# EAGLE board clock (EAGLE 6.2)
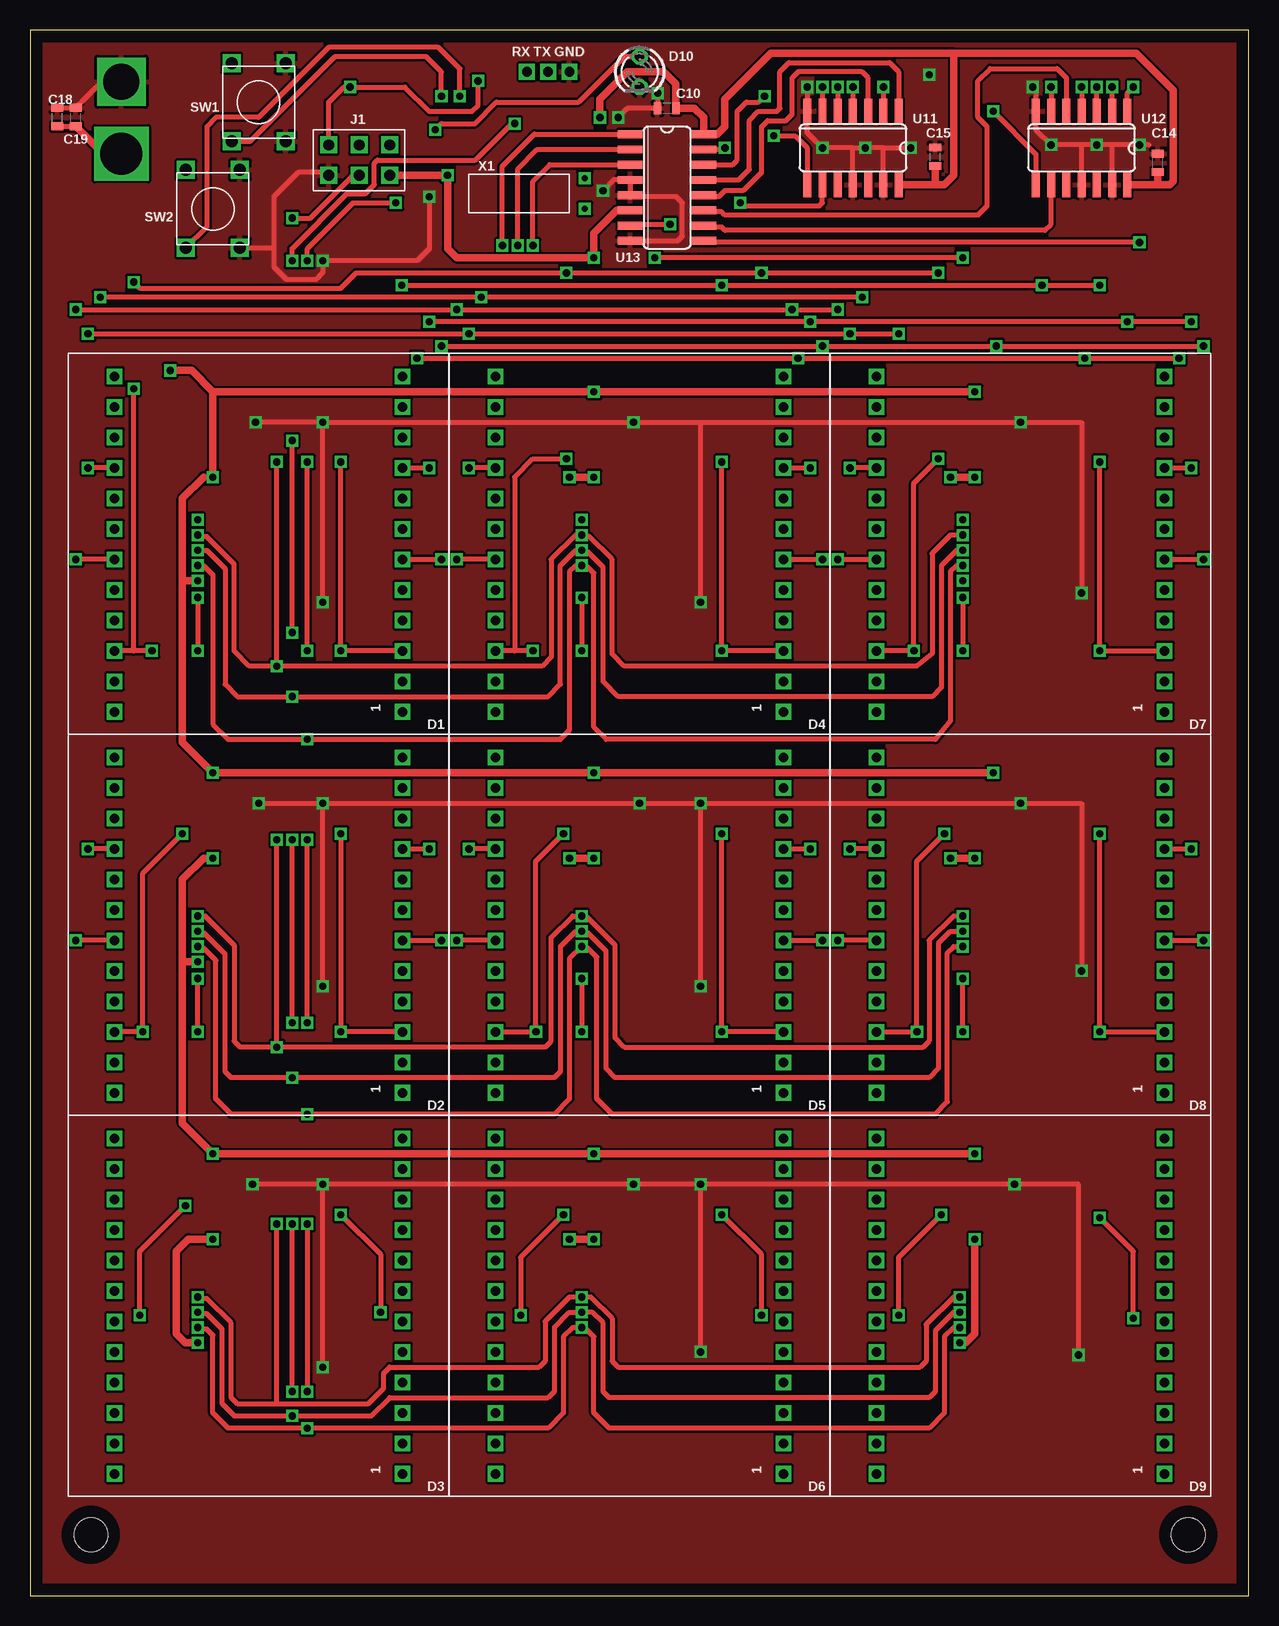
[diagram p3: board, top side]
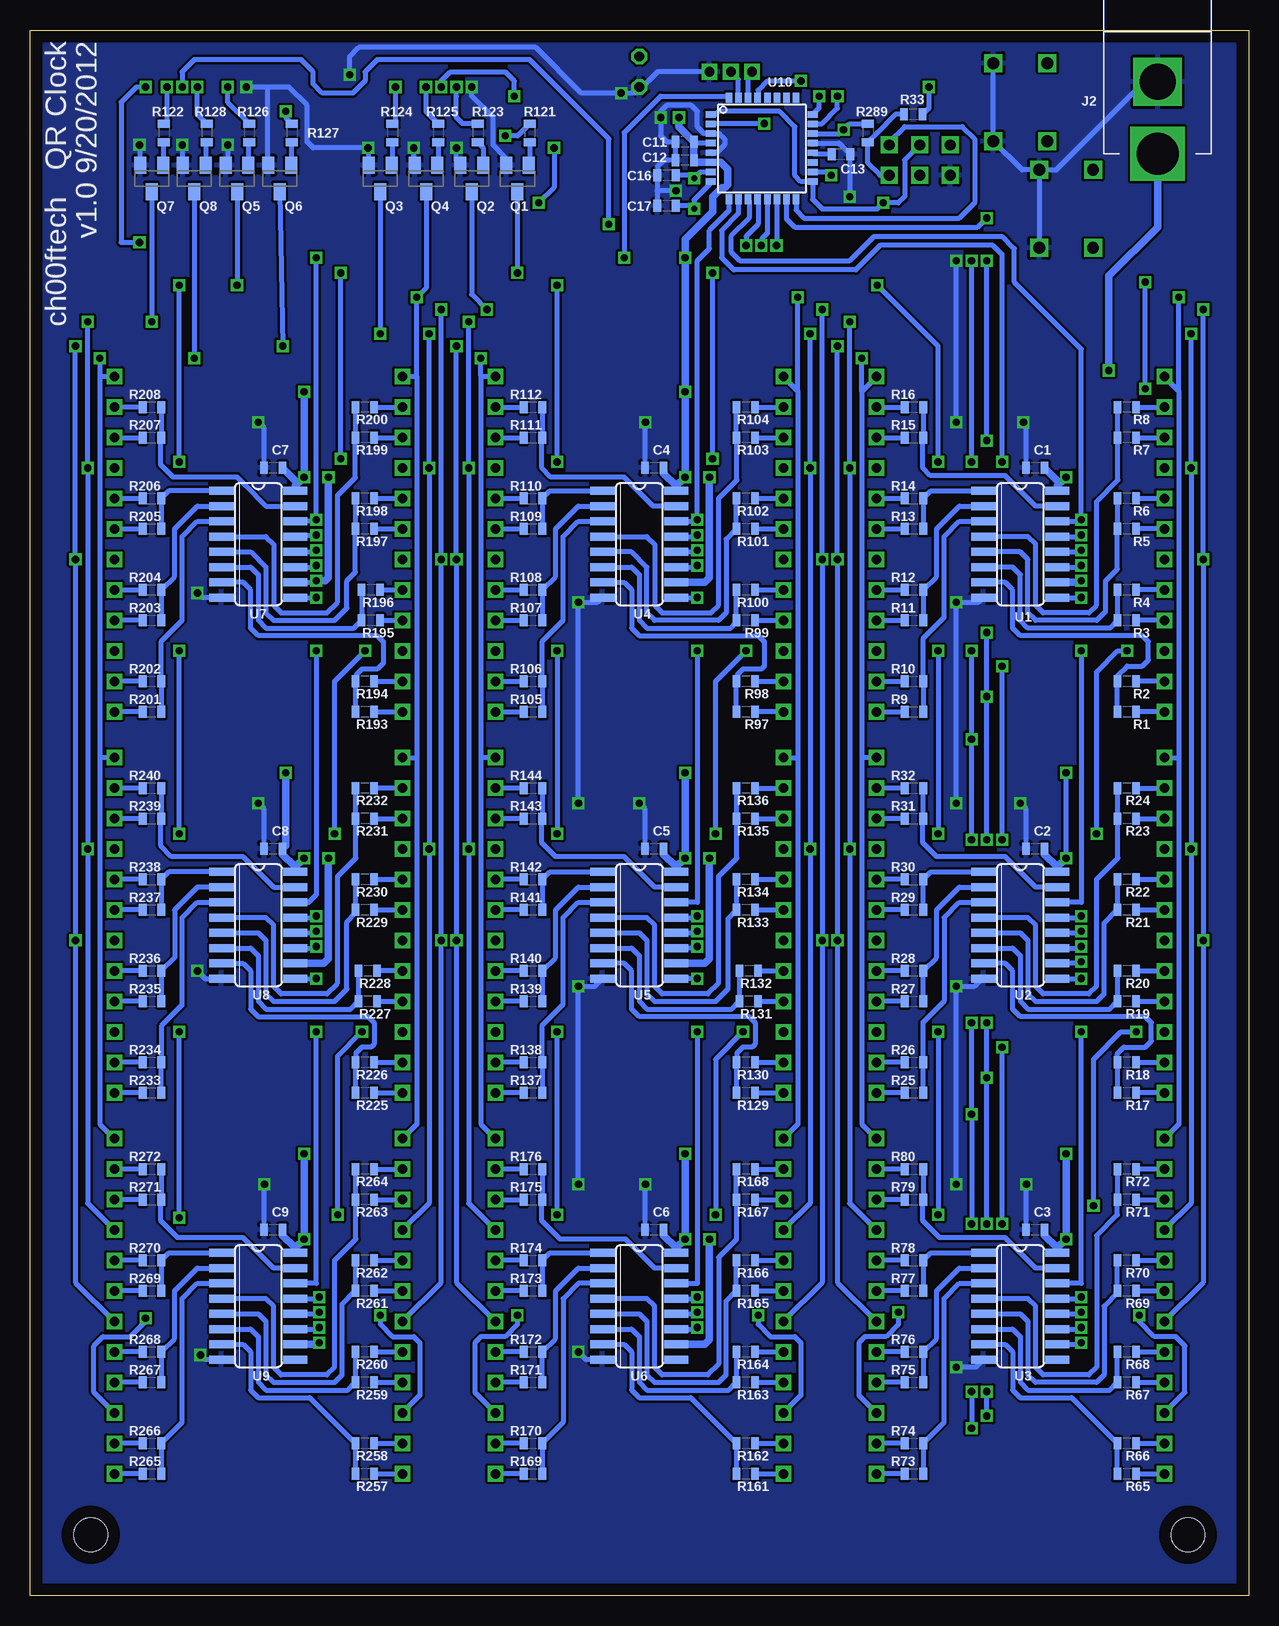
[diagram p4: board, bottom side, seen from below]

Size 101.58 x 130.48 mm. Coordinates in mm from the lower left corner, seen from the top.
Outline: 0,0 101.58,0 101.58,130.48 0,130.48 0,0
Copper layers (1*16): Top 0.035mm / dielectric 1.5mm / Bottom 0.035mm
Design rules: minimum track width 10mil, minimum drill 6mil, track to track 8mil, track to pad 8mil, pad to pad 8mil, via to via 8mil, smd to smd 8mil, copper to edge 40mil, drill to drill 8mil, minimum pad ring 10mil, minimum via ring 8mil, stop-mask expansion 4mil, vias tented up to drill 0mil, thermal gap 10mil
Holes 2.8 mm at 5.08,5.08 96.52,5.08

## Footprints (pad centres in the part's own frame; a part is rotated, then mirrored left to right if it is on the bottom)
0603/1608METRIC = smd 0.65 x 1: P1 -0.74,0; P2 0.8,0
BL-M12A883DUG-11 = drill 0.8 square: P1 -13.97,-12; P2 -11.43,-12; P3 -8.89,-12; P4 -6.35,-12; P5 -3.81,-12; P6 -1.27,-12; P7 1.27,-12; P8 3.81,-12; P9 6.35,-12; P10 8.89,-12; P11 11.43,-12; P12 13.97,-12; P13 13.97,12; P14 11.43,12; P15 8.89,12; P16 6.35,12; P17 3.81,12; P18 1.27,12; P19 -1.27,12; P20 -3.81,12; P21 -6.35,12; P22 -8.89,12; P23 -11.43,12; P24 -13.97,12
LED3MM = drill 0.813 octagon: A -1.27,0; K 1.27,0
HEADERPIN = drill 0.8 square: P$1 0,0
ATMEL-PROGRAMMING-HEADER = drill 0.9 square: P1 -2.54,-1.27; P2 -2.54,1.27; P3 0,-1.27; P4 0,1.27; P5 2.54,-1.27; P6 2.54,1.27
PJ-037A = drill 3 square: BARREL 7.696,0 | drill 3.5 square: PIN 13.691,0
SOT23 = smd 1 x 1.4: 1 -0.95,-1.1; 2 0.95,-1.1; 3 0,1.1
FSM16JHSWITCH = drill 0.991 square: P1 3.251,2.248; P2 -3.251,2.248; P3 3.251,-2.248; P4 -3.251,-2.248
SO16 = smd 0.66 x 2.032: 1 -4.445,-3.073; 2 -3.175,-3.073; 3 -1.905,-3.073; 4 -0.635,-3.073; 5 0.635,-3.073; 6 1.905,-3.073; 7 3.175,-3.073; 8 4.445,-3.073; 9 4.445,3.073; 10 3.175,3.073; 11 1.905,3.073; 12 0.635,3.073; 13 -0.635,3.073; 14 -1.905,3.073; 15 -3.175,3.073; 16 -4.445,3.073
TQFP-32 = smd 0.85 x 0.54: P1 -4.22,2.8; P2 -4.22,2; P3 -4.22,1.2; P4 -4.22,0.4; P5 -4.22,-0.4; P6 -4.22,-1.2; P7 -4.22,-2; P8 -4.22,-2.8; P17 4.28,-2.8; P18 4.28,-2; P19 4.28,-1.2; P20 4.28,-0.4; P21 4.28,0.4; P22 4.28,1.2; P23 4.28,2; P24 4.28,2.8 | smd 0.54 x 0.85: P9 -2.7,-4.28; P10 -1.9,-4.28; P11 -1.1,-4.28; P12 -0.3,-4.28; P13 0.5,-4.28; P14 1.3,-4.28; P15 2.1,-4.28; P16 2.9,-4.28; P25 2.9,4.18; P26 2.1,4.18; P27 1.3,4.18; P28 0.5,4.18; P29 -0.3,4.18; P30 -1.1,4.18; P31 -1.9,4.18; P32 -2.7,4.18
SO14 = smd 0.66 x 2.032: 1 -3.81,-3.073; 2 -2.54,-3.073; 3 -1.27,-3.073; 4 0,-3.073; 5 1.27,-3.073; 6 2.54,-3.073; 7 3.81,-3.073; 8 3.81,3.073; 9 2.54,3.073; 10 1.27,3.073; 11 0,3.073; 12 -1.27,3.073; 13 -2.54,3.073; 14 -3.81,3.073
AB38T = drill 0.5 square: P$1 2.54,1.27; P$2 2.54,-1.27

## Placement (x,y rotation side)
C1  .1uF  [0603/1608METRIC]  17.78,93.98 180 bottom
C2  .1uF  [0603/1608METRIC]  17.78,62.23 180 bottom
C3  .1uF  [0603/1608METRIC]  17.78,30.48 180 bottom
C4  .1uF  [0603/1608METRIC]  49.53,93.98 180 bottom
C5  .1uF  [0603/1608METRIC]  49.53,62.23 180 bottom
C6  .1uF  [0603/1608METRIC]  49.53,30.48 180 bottom
C7  .1uF  [0603/1608METRIC]  81.28,93.98 180 bottom
C8  .1uF  [0603/1608METRIC]  81.28,62.23 180 bottom
C9  .1uF  [0603/1608METRIC]  81.28,30.48 180 bottom
C10  .1uF  [0603/1608METRIC]  53.09,123.95 180 top
C11  .1uF  [0603/1608METRIC]  46.99,121.16 180 bottom
C12  .1uF  [0603/1608METRIC]  46.99,119.63 180 bottom
C13  .1uF  [0603/1608METRIC]  34.04,120.14 0 bottom
C14  .1uF  [0603/1608METRIC]  93.98,119.38 90 top
C15  .1uF  [0603/1608METRIC]  75.44,119.89 90 top
C16  6pF  [0603/1608METRIC]  48.51,118.36 180 bottom
C17  16pF  [0603/1608METRIC]  48.51,115.82 180 bottom
C18  1uF  [0603/1608METRIC]  2.29,123.19 90 top
C19  1uF  [0603/1608METRIC]  3.81,123.19 90 top
D1  BL-M12A883DUG-11"  [BL-M12A883DUG-11]  19.05,87.63 90 top
D2  BL-M12A883DUG-11"  [BL-M12A883DUG-11]  19.05,55.88 90 top
D3  BL-M12A883DUG-11"  [BL-M12A883DUG-11]  19.05,24.13 90 top
D4  BL-M12A883DUG-11"  [BL-M12A883DUG-11]  50.8,87.63 90 top
D5  BL-M12A883DUG-11"  [BL-M12A883DUG-11]  50.8,55.88 90 top
D6  BL-M12A883DUG-11"  [BL-M12A883DUG-11]  50.8,24.13 90 top
D7  BL-M12A883DUG-11"  [BL-M12A883DUG-11]  82.55,87.63 90 top
D8  BL-M12A883DUG-11"  [BL-M12A883DUG-11]  82.55,55.88 90 top
D9  BL-M12A883DUG-11"  [BL-M12A883DUG-11]  82.55,24.13 90 top
D10  TEPT4400  [LED3MM]  50.8,127 270 top
GND  HEADERPIN  [HEADERPIN]  44.96,127 0 top
J1  PROGHEADER-PINS  [ATMEL-PROGRAMMING-HEADER]  27.43,119.63 180 top
J2  [PJ-037A]  7.62,133.86 270 bottom
Q1  FDN335  [SOT23]  60.96,118.11 180 bottom
Q2  FDN335  [SOT23]  64.77,118.11 180 bottom
Q3  FDN335  [SOT23]  72.39,118.11 180 bottom
Q4  FDN335  [SOT23]  68.58,118.11 180 bottom
Q5  FDN335  [SOT23]  84.33,118.11 180 bottom
Q6  FDN335  [SOT23]  80.77,118.11 180 bottom
Q7  FDN335  [SOT23]  91.44,118.11 180 bottom
Q8  FDN335  [SOT23]  87.88,118.11 180 bottom
R1  100  [0603/1608METRIC]  10.16,73.66 180 bottom
R2  100  [0603/1608METRIC]  10.16,76.2 180 bottom
R3  100  [0603/1608METRIC]  10.16,81.28 180 bottom
R4  100  [0603/1608METRIC]  10.16,83.82 180 bottom
R5  100  [0603/1608METRIC]  10.16,88.9 180 bottom
R6  100  [0603/1608METRIC]  10.16,91.44 180 bottom
R7  100  [0603/1608METRIC]  10.16,96.52 180 bottom
R8  100  [0603/1608METRIC]  10.16,99.06 180 bottom
R9  100  [0603/1608METRIC]  27.94,73.66 0 bottom
R10  100  [0603/1608METRIC]  27.94,76.2 0 bottom
R11  100  [0603/1608METRIC]  27.94,81.28 0 bottom
R12  100  [0603/1608METRIC]  27.94,83.82 0 bottom
R13  100  [0603/1608METRIC]  27.94,88.9 0 bottom
R14  100  [0603/1608METRIC]  27.94,91.44 0 bottom
R15  100  [0603/1608METRIC]  27.94,96.52 0 bottom
R16  100  [0603/1608METRIC]  27.94,99.06 0 bottom
R17  100  [0603/1608METRIC]  10.16,41.91 180 bottom
R18  100  [0603/1608METRIC]  10.16,44.45 180 bottom
R19  100  [0603/1608METRIC]  10.16,49.53 180 bottom
R20  100  [0603/1608METRIC]  10.16,52.07 180 bottom
R21  100  [0603/1608METRIC]  10.16,57.15 180 bottom
R22  100  [0603/1608METRIC]  10.16,59.69 180 bottom
R23  100  [0603/1608METRIC]  10.16,64.77 180 bottom
R24  100  [0603/1608METRIC]  10.16,67.31 180 bottom
R25  100  [0603/1608METRIC]  27.94,41.91 0 bottom
R26  100  [0603/1608METRIC]  27.94,44.45 0 bottom
R27  100  [0603/1608METRIC]  27.94,49.53 0 bottom
R28  100  [0603/1608METRIC]  27.94,52.07 0 bottom
R29  100  [0603/1608METRIC]  27.94,57.15 0 bottom
R30  100  [0603/1608METRIC]  27.94,59.69 0 bottom
R31  100  [0603/1608METRIC]  27.94,64.77 0 bottom
R32  100  [0603/1608METRIC]  27.94,67.31 0 bottom
R33  4.7k  [0603/1608METRIC]  27.94,123.44 180 bottom
R65  100  [0603/1608METRIC]  10.16,10.16 180 bottom
R66  100  [0603/1608METRIC]  10.16,12.7 180 bottom
R67  100  [0603/1608METRIC]  10.16,17.78 180 bottom
R68  100  [0603/1608METRIC]  10.16,20.32 180 bottom
R69  100  [0603/1608METRIC]  10.16,25.4 180 bottom
R70  100  [0603/1608METRIC]  10.16,27.94 180 bottom
R71  100  [0603/1608METRIC]  10.16,33.02 180 bottom
R72  100  [0603/1608METRIC]  10.16,35.56 180 bottom
R73  100  [0603/1608METRIC]  27.94,10.16 0 bottom
R74  100  [0603/1608METRIC]  27.94,12.7 0 bottom
R75  100  [0603/1608METRIC]  27.94,17.78 0 bottom
R76  100  [0603/1608METRIC]  27.94,20.32 0 bottom
R77  100  [0603/1608METRIC]  27.94,25.4 0 bottom
R78  100  [0603/1608METRIC]  27.94,27.94 0 bottom
R79  100  [0603/1608METRIC]  27.94,33.02 0 bottom
R80  100  [0603/1608METRIC]  27.94,35.56 0 bottom
R97  100  [0603/1608METRIC]  41.91,73.66 180 bottom
R98  100  [0603/1608METRIC]  41.91,76.2 180 bottom
R99  100  [0603/1608METRIC]  41.91,81.28 180 bottom
R100  100  [0603/1608METRIC]  41.91,83.82 180 bottom
R101  100  [0603/1608METRIC]  41.91,88.9 180 bottom
R102  100  [0603/1608METRIC]  41.91,91.44 180 bottom
R103  100  [0603/1608METRIC]  41.91,96.52 180 bottom
R104  100  [0603/1608METRIC]  41.91,99.06 180 bottom
R105  100  [0603/1608METRIC]  59.69,73.66 0 bottom
R106  100  [0603/1608METRIC]  59.69,76.2 0 bottom
R107  100  [0603/1608METRIC]  59.69,81.28 0 bottom
R108  100  [0603/1608METRIC]  59.69,83.82 0 bottom
R109  100  [0603/1608METRIC]  59.69,88.9 0 bottom
R110  100  [0603/1608METRIC]  59.69,91.44 0 bottom
R111  100  [0603/1608METRIC]  59.69,96.52 0 bottom
R112  100  [0603/1608METRIC]  59.69,99.06 0 bottom
R121  2k  [0603/1608METRIC]  59.94,121.92 270 bottom
R122  2k  [0603/1608METRIC]  90.42,121.92 270 bottom
R123  2k  [0603/1608METRIC]  64.26,121.92 270 bottom
R124  2k  [0603/1608METRIC]  71.37,121.92 270 bottom
R125  2k  [0603/1608METRIC]  67.56,121.92 270 bottom
R126  2k  [0603/1608METRIC]  83.31,121.92 270 bottom
R127  2k  [0603/1608METRIC]  79.76,121.92 270 bottom
R128  2k  [0603/1608METRIC]  86.87,121.92 270 bottom
R129  100  [0603/1608METRIC]  41.91,41.91 180 bottom
R130  100  [0603/1608METRIC]  41.91,44.45 180 bottom
R131  100  [0603/1608METRIC]  41.66,49.53 180 bottom
R132  100  [0603/1608METRIC]  41.66,52.07 180 bottom
R133  100  [0603/1608METRIC]  41.91,57.15 180 bottom
R134  100  [0603/1608METRIC]  41.91,59.69 180 bottom
R135  100  [0603/1608METRIC]  41.91,64.77 180 bottom
R136  100  [0603/1608METRIC]  41.91,67.31 180 bottom
R137  100  [0603/1608METRIC]  59.69,41.91 0 bottom
R138  100  [0603/1608METRIC]  59.69,44.45 0 bottom
R139  100  [0603/1608METRIC]  59.69,49.53 0 bottom
R140  100  [0603/1608METRIC]  59.69,52.07 0 bottom
R141  100  [0603/1608METRIC]  59.69,57.15 0 bottom
R142  100  [0603/1608METRIC]  59.69,59.69 0 bottom
R143  100  [0603/1608METRIC]  59.69,64.77 0 bottom
R144  100  [0603/1608METRIC]  59.69,67.31 0 bottom
R161  100  [0603/1608METRIC]  41.91,10.16 180 bottom
R162  100  [0603/1608METRIC]  41.91,12.7 180 bottom
R163  100  [0603/1608METRIC]  41.91,17.78 180 bottom
R164  100  [0603/1608METRIC]  41.91,20.32 180 bottom
R165  100  [0603/1608METRIC]  41.91,25.4 180 bottom
R166  100  [0603/1608METRIC]  41.91,27.94 180 bottom
R167  100  [0603/1608METRIC]  41.91,33.02 180 bottom
R168  100  [0603/1608METRIC]  41.91,35.56 180 bottom
R169  100  [0603/1608METRIC]  59.69,10.16 0 bottom
R170  100  [0603/1608METRIC]  59.69,12.7 0 bottom
R171  100  [0603/1608METRIC]  59.69,17.78 0 bottom
R172  100  [0603/1608METRIC]  59.69,20.32 0 bottom
R173  100  [0603/1608METRIC]  59.69,25.4 0 bottom
R174  100  [0603/1608METRIC]  59.69,27.94 0 bottom
R175  100  [0603/1608METRIC]  59.69,33.02 0 bottom
R176  100  [0603/1608METRIC]  59.69,35.56 0 bottom
R193  100  [0603/1608METRIC]  73.66,73.66 180 bottom
R194  100  [0603/1608METRIC]  73.66,76.2 180 bottom
R195  100  [0603/1608METRIC]  73.15,81.28 180 bottom
R196  100  [0603/1608METRIC]  73.15,83.82 180 bottom
R197  100  [0603/1608METRIC]  73.66,88.9 180 bottom
R198  100  [0603/1608METRIC]  73.66,91.44 180 bottom
R199  100  [0603/1608METRIC]  73.66,96.52 180 bottom
R200  100  [0603/1608METRIC]  73.66,99.06 180 bottom
R201  100  [0603/1608METRIC]  91.44,73.66 0 bottom
R202  100  [0603/1608METRIC]  91.44,76.2 0 bottom
R203  100  [0603/1608METRIC]  91.44,81.28 0 bottom
R204  100  [0603/1608METRIC]  91.44,83.82 0 bottom
R205  100  [0603/1608METRIC]  91.44,88.9 0 bottom
R206  100  [0603/1608METRIC]  91.44,91.44 0 bottom
R207  100  [0603/1608METRIC]  91.44,96.52 0 bottom
R208  100  [0603/1608METRIC]  91.44,99.06 0 bottom
R225  100  [0603/1608METRIC]  73.66,41.91 180 bottom
R226  100  [0603/1608METRIC]  73.66,44.45 180 bottom
R227  100  [0603/1608METRIC]  73.41,49.53 180 bottom
R228  100  [0603/1608METRIC]  73.41,52.07 180 bottom
R229  100  [0603/1608METRIC]  73.66,57.15 180 bottom
R230  100  [0603/1608METRIC]  73.66,59.69 180 bottom
R231  100  [0603/1608METRIC]  73.66,64.77 180 bottom
R232  100  [0603/1608METRIC]  73.66,67.31 180 bottom
R233  100  [0603/1608METRIC]  91.44,41.91 0 bottom
R234  100  [0603/1608METRIC]  91.44,44.45 0 bottom
R235  100  [0603/1608METRIC]  91.44,49.53 0 bottom
R236  100  [0603/1608METRIC]  91.44,52.07 0 bottom
R237  100  [0603/1608METRIC]  91.44,57.15 0 bottom
R238  100  [0603/1608METRIC]  91.44,59.69 0 bottom
R239  100  [0603/1608METRIC]  91.44,64.77 0 bottom
R240  100  [0603/1608METRIC]  91.44,67.31 0 bottom
R257  100  [0603/1608METRIC]  73.66,10.16 180 bottom
R258  100  [0603/1608METRIC]  73.66,12.7 180 bottom
R259  100  [0603/1608METRIC]  73.66,17.78 180 bottom
R260  100  [0603/1608METRIC]  73.66,20.32 180 bottom
R261  100  [0603/1608METRIC]  73.66,25.4 180 bottom
R262  100  [0603/1608METRIC]  73.66,27.94 180 bottom
R263  100  [0603/1608METRIC]  73.66,33.02 180 bottom
R264  100  [0603/1608METRIC]  73.66,35.56 180 bottom
R265  100  [0603/1608METRIC]  91.44,10.16 0 bottom
R266  100  [0603/1608METRIC]  91.44,12.7 0 bottom
R267  100  [0603/1608METRIC]  91.44,17.78 0 bottom
R268  100  [0603/1608METRIC]  91.44,20.32 0 bottom
R269  100  [0603/1608METRIC]  91.44,25.4 0 bottom
R270  100  [0603/1608METRIC]  91.44,27.94 0 bottom
R271  100  [0603/1608METRIC]  91.44,33.02 0 bottom
R272  100  [0603/1608METRIC]  91.44,35.56 0 bottom
R289  47k  [0603/1608METRIC]  31.75,121.92 270 bottom
RX  HEADERPIN  [HEADERPIN]  41.4,127 0 top
SW1  4mm  [FSM16JHSWITCH]  19.05,124.46 90 top
SW2  4mm  [FSM16JHSWITCH]  15.24,115.57 90 top
TX  HEADERPIN  [HEADERPIN]  43.18,127 0 top
U1  74HC595  [SO16]  19.05,87.63 270 bottom
U2  74HC595  [SO16]  19.05,55.88 270 bottom
U3  74HC595  [SO16]  19.05,24.13 270 bottom
U4  74HC595  [SO16]  50.8,87.63 270 bottom
U5  74HC595  [SO16]  50.8,55.88 270 bottom
U6  74HC595  [SO16]  50.8,24.13 270 bottom
U7  74HC595  [SO16]  82.55,87.63 270 bottom
U8  74HC595  [SO16]  82.55,55.88 270 bottom
U9  74HC595  [SO16]  82.55,24.13 270 bottom
U10  ATMega48A  [TQFP-32]  40.64,120.65 0 bottom
U11  74HC14  [SO14]  68.58,120.65 180 top
U12  74HC14  [SO14]  87.63,120.65 180 top
U13  74HC138  [SO16]  53.09,117.35 270 top
X1  [AB38T]  43.69,116.84 0 top

## Tracks (layer width: path | path; a pad name or v marks a point on that pad's centre or on a via)
!OE  (via drill 0.6)
  Top 0.406: v13.97,24.89 14.1,24.77 14.73,24.77 16.76,22.73 16.76,16.51 17.27,16 20.57,16 | v77.47,24.89 76.96,24.89 74.68,22.61 74.68,19.56 74.17,19.05 49.02,19.05 48.51,19.56 48.51,23.11 46.74,24.89 v45.97,24.89 44.96,24.89 42.93,22.86 42.93,19.56 42.42,19.05 29.97,19.05 29.46,18.54 29.46,17.27 28.19,16 20.57,16 | v20.57,45.72 42.93,45.72 43.43,46.23 43.43,54.86 45.21,56.64 v45.97,56.64 | v20.57,45.72 17.53,45.72 17.02,46.23 17.02,54.23 14.61,56.64 v13.97,56.64 | v77.72,56.64 76.96,56.64 74.93,54.61 74.93,46.23 74.42,45.72 49.53,45.72 48.77,46.48 48.77,54.23 46.48,56.52 46.1,56.52 v45.97,56.64 | v45.97,56.64 46.23,56.64 | v20.57,77.47 42.67,77.47 43.43,78.23 43.43,86.36 45.47,88.39 v45.97,88.39 46.35,88.39 46.48,88.27 46.61,88.27 48.51,86.36 48.51,78.49 49.53,77.47 73.91,77.47 75.18,78.49 75.18,86.87 76.71,88.39 v77.72,88.39 | v20.57,77.47 18.29,77.47 17.02,78.74 17.02,85.98 14.73,88.27 14.1,88.27 v13.97,88.39 | 20.57,16 v20.57,30.99 | v20.57,45.72 v20.57,62.99 | v20.57,77.47 v20.57,94.49
  Bottom 0.406: U3.13 14.1,24.77 v13.97,24.89 | U9.13 77.6,24.77 v77.47,24.89 | U8.13 77.6,56.52 v77.72,56.64 | U1.13 14.1,88.27 v13.97,88.39 | U6.13 46.1,24.77 v45.97,24.89 | U2.13 14.1,56.52 v13.97,56.64 | U5.13 46.1,56.52 v45.97,56.64 | U4.13 46.1,88.27 v45.97,88.39 | U7.13 79.35,88.39 v77.72,88.39 | v20.57,30.99 v20.57,45.72 | v20.57,62.99 v20.57,77.47 | v20.57,94.49 20.57,111.76 21.34,112.52 30.73,112.52 32.77,110.49 42.93,110.49 43.94,111.51 43.94,113.79 42.54,115.19 U10.P10
!RESET  (via drill 0.6)
  Top 0.406: J1.P5 24.89,124.46 26.16,125.73 v26.67,125.73 31.24,125.73 33.27,123.7 36.83,123.7 37.34,124.21 v37.34,126.24
  Bottom 0.406: U10.P29 40.89,124.88 40.89,125.48 40.13,126.24 v37.34,126.24 | v26.67,125.73 26.67,123.97 R33.P1
+5V  (via drill 0.6)
  Top 0.406: 14.48,93.22 v15.24,93.22 | 72.42,117.6 U11.14 | 56.13,121.82 U13.16 | C18.P1 C19.P1
  Top 0.61: v44.96,29.72 v46.99,29.72 | v44.96,61.47 v46.99,61.47 | v76.71,61.47 v78.74,61.47 | v13.97,21.08 12.95,21.08 12.19,21.84 12.19,28.7 13.21,29.72 v15.24,29.72 | v77.47,21.08 77.98,21.08 78.74,21.84 v78.74,29.72 | v78.74,36.83 v46.99,36.83 v15.24,36.83 12.7,39.37 12.7,52.83 | 12.7,52.83 12.7,59.69 14.48,61.47 v15.24,61.47 | v80.26,68.58 v46.99,68.58 v15.24,68.58 12.7,71.12 12.7,84.58 | v13.97,52.83 12.7,52.83 | 12.7,84.58 12.7,91.44 14.48,93.22 | v44.96,93.22 v46.99,93.22 | v76.71,93.22 v78.74,93.22 | 15.24,100.33 v46.99,100.33 v78.74,100.33 | 15.24,100.33 v15.24,93.22 | v13.97,84.58 12.7,84.58 | U12.14 93.98,117.58 | 93.98,117.58 C14.P1 | 75.44,117.6 76.2,117.6 76.96,118.36 76.96,128.52 | 75.44,117.6 72.42,117.6 | 93.98,117.58 94.97,117.58 95.25,117.86 95.25,125.48 92.2,128.52 76.96,128.52 | U13.16 57.28,121.79 57.91,122.43 57.91,124.71 61.72,128.52 76.96,128.52 | U13.6 48.9,115.44 46.99,113.54 v46.99,111.51 35.56,111.51 34.8,112.27 v34.8,118.36 J1.P2 | 56.13,121.82 56.13,123.19 55.37,123.95 C10.P1 53.83,126.01 52.83,127 49.78,127 47.5,124.71 v47.5,123.19 | C19.P1 6.09,120.17 J2.PIN | 15.24,100.33 13.46,102.11 v11.68,102.11 | C15.P1 75.44,117.6
  Bottom 0.406: U2.16 15.98,60.73 | v13.97,52.83 14.1,52.7 U2.10 | U3.16 15.98,28.98 | U5.16 47.73,60.73 | 77.6,20.95 v77.47,21.08 | U6.16 47.73,28.98 | U9.16 79.48,28.98 | U3.10 14.1,20.95 v13.97,21.08 | U8.16 79.48,60.73 | U7.10 77.72,84.45 | 77.72,84.45 77.6,84.45 | U7.16 79.48,92.48 79.48,92.92 | 14.1,84.45 v13.97,84.58 | U1.16 15.98,92.48 15.98,92.92 | U4.16 47.73,92.48 | 17.04,30.05 C3.P1 | v15.24,61.47 v15.24,68.58 | C8.P1 80.26,62.51 | 48.79,93.55 C4.P1 | v34.8,118.36 35.05,118.62 36.33,118.62 U10.P18 | J1.P2 30.73,118.36 31.75,119.38 R289.P2 30.99,121.88 30.99,121.92 29.46,123.44 R33.P2 | 46.07,119.45 C12.P1 | v77.72,84.58 77.72,84.45 | U10.P4 46.14,121.05 C11.P1
  Bottom 0.61: v15.24,61.47 15.98,60.73 17.04,61.8 C2.P1 | U9.10 77.6,20.95 | v78.74,61.47 79.48,60.73 80.54,61.8 C8.P1 | 79.48,92.48 v78.74,93.22 v78.74,100.33 | U1.10 14.1,84.45 | 15.98,92.48 v15.24,93.22 | U6.10 45.34,20.95 44.96,21.34 v44.96,29.72 | U5.10 45.34,52.7 44.96,53.09 v44.96,61.47 | v76.71,61.47 76.71,53.09 77.09,52.7 U8.10 | 17.04,30.05 15.98,28.98 v15.24,29.72 v15.24,36.83 | C6.P1 48.79,30.05 47.73,28.98 v46.99,29.72 v46.99,36.83 | C9.P1 80.54,30.05 79.48,28.98 v78.74,29.72 v78.74,36.83 | C5.P1 48.79,61.8 47.73,60.73 v46.99,61.47 v46.99,68.58 | 80.26,62.51 v80.26,68.58 | U4.10 45.34,84.45 44.96,84.84 v44.96,93.22 | 15.98,92.92 C1.P1 | 79.48,92.92 C7.P1 | v77.72,84.58 76.96,84.58 76.71,84.84 v76.71,93.22 | 48.79,93.55 47.73,92.48 v46.99,93.22 v46.99,100.33 v46.99,111.51 46.99,113.03 44.7,115.32 44.7,116.59 43.94,117.35 43.69,117.35 43.43,117.6 43.43,118.87 44.01,119.45 U10.P6 46.07,119.45 | C12.P1 C11.P1 46.25,121.18 47.5,122.43 v47.5,123.19 | v11.68,102.11 11.68,109.98 7.62,114.05 J2.PIN
GND  (via drill 0.6)
  Top 0.406: v24.38,19.05 v24.38,34.29 | v55.88,34.29 v50.29,34.29 v24.38,34.29 | v24.38,34.29 v18.54,34.29 | v55.88,20.32 v55.88,34.29 | v87.38,20.07 87.38,34.29 v82.04,34.29 v55.88,34.29 | v19.05,66.04 v24.38,66.04 | v24.38,50.8 v24.38,66.04 | v24.38,66.04 v50.8,66.04 v55.88,66.04 | v55.88,66.04 v82.55,66.04 87.63,66.04 v87.63,52.07 | v55.88,50.8 v55.88,66.04 | v24.38,82.8 v24.38,97.79 | v24.38,97.79 v18.8,97.79 | v24.38,97.79 v50.29,97.79 55.88,97.79 | 55.88,97.79 v82.55,97.79 87.63,97.79 v87.63,83.57 | v55.88,82.8 55.88,97.79 | U11.11 68.58,120.65 | 68.58,120.65 v69.6,120.65 71.12,120.65 | 68.58,120.65 v66.04,120.65 64.77,121.92 U11.7 v64.77,125.73 | U11.13 71.12,120.65 | 71.12,120.65 v73.41,120.65 | U12.11 87.63,120.9 | 87.63,120.9 v85.09,120.9 83.82,122.17 U12.7 83.82,125.48 v83.57,125.73 | U12.13 90.17,120.9 | 90.17,120.9 v88.9,120.9 87.63,120.9 | 90.17,120.9 v92.46,120.9 93.26,120.9 | v52.32,125.22 52.32,123.99 C10.P2 49.78,123.95 v49.02,123.19 | U13.8 53.98,112.9 54.36,113.28 54.36,116.08 53.85,116.59 50.14,116.59 U13.5 U13.4 48.64,117.98 v47.75,117.09 | v33.27,116.59 33.27,112.27 32.26,111.25 v24.38,111.25 24.38,110.24 23.88,109.73 21.34,109.73 20.32,110.74 20.32,112.27 | J1.P6 24.64,118.62 22.35,118.62 20.32,116.59 20.32,112.27 | SW2.P4 20.27,112.32 20.32,112.27 | J2.BARREL 5.98,126.16 C19.P2 C18.P2
  Bottom 0.406: U3.8 22.76,19.05 v24.38,19.05 | C3.P2 18.58,33.82 v18.54,34.29 | U6.8 55.24,19.69 v55.88,20.32 | C6.P2 50.33,34.25 v50.29,34.29 | U9.8 87,19.69 v87.38,20.07 | C9.P2 82.08,34.29 v82.04,34.29 | v24.38,34.29 v24.38,50.8 22.86,50.8 22.1,51.56 | C2.P2 18.58,65.57 v19.05,66.04 | v87.63,52.07 87,51.44 U8.8 | v55.88,34.29 v55.88,50.8 54.51,50.8 U5.8 | C5.P2 50.33,65.57 v50.8,66.04 | C8.P2 82.08,65.57 v82.55,66.04 | v24.38,66.04 v24.38,82.8 22.5,82.8 U1.8 22.25,83.06 | v55.88,66.04 v55.88,82.8 54.25,82.8 U4.8 | C1.P2 18.58,97.57 v18.8,97.79 | U7.8 87.25,83.19 v87.63,83.57 | C7.P2 82.08,97.32 v82.55,97.79 | C4.P2 50.33,97.75 v50.29,97.79 | v24.38,97.79 v24.38,111.25 | Q2.2 66.04,119.53 v66.04,120.65 | Q4.2 69.6,119.28 v69.6,120.65 | Q3.2 73.41,119.21 v73.41,120.65 77.98,120.65 78.49,121.16 78.49,124.21 80.01,125.73 81.79,125.73 | v85.09,120.9 85.09,119.4 Q5.2 | Q8.2 88.83,120.9 v88.9,120.9 | Q7.2 92.39,120.9 v92.46,120.9 | 81.79,125.73 v83.57,125.73 | Q6.2 81.79,119.28 81.79,125.73 | Q1.2 61.98,119.28 61.98,119.89 62.99,120.9 62.99,123.19 64.77,124.97 v64.77,125.73 | 47.75,121.2 C11.P2 | C11.P2 C12.P2 48.77,119.63 49.28,119.13 49.28,118.4 C16.P2 49.31,117.09 | 49.31,117.09 C17.P2 | v74.93,126.75 74.93,128.27 74.17,129.03 59.44,129.03 55.63,125.22 v52.32,125.22 51.05,125.22 49.28,127 GND.P$1 | v47.75,117.09 49.31,117.09 | C11.P2 48.51,121.16 49.02,121.67 v49.02,123.19 49.02,123.7 48.51,124.21 46.48,124.21 45.97,123.7 45.97,122.43 45.4,121.85 U10.P3 44.13,121.85 43.69,121.41 43.69,120.9 44.34,120.25 U10.P5 | C13.P2 33.24,120.1 | C13.P2 33.27,120.1 v33.27,116.59 | SW1.P3 SW1.P4 18.91,118.82 SW2.P3
  Bottom 0.406: SW2.P3 SW2.P4 | SW2.P3 16.05,118.82 8.71,126.16 J2.BARREL | U10.P21 34.14,121.05 C13.P2
  pour Bottom: 0.51,130.05 0.51,0.51 101.09,0.51 101.09,130.05
  pour Top: 0.25,130.3 0.25,0.25 101.35,0.25 101.35,130.3
MISO
  Bottom 0.406: U10.P16 37.74,115.46 37.08,114.81 24.13,114.81 22.86,116.08 22.86,121.41 23.88,122.43 28.7,122.43 29.97,121.16 J1.P1
MOSI  (via drill 0.6)
  Top 0.406: v21.84,114.81 23.37,114.81 26.92,118.36 J1.P4
  Bottom 0.406: U10.P15 38.54,114.74 37.85,114.05 22.61,114.05 v21.84,114.81
N$1
  Bottom 0.406: D1.P24 R1.P1
N$2
  Bottom 0.406: D1.P23 R2.P1
N$3
  Bottom 0.406: D1.P21 R3.P1
N$4
  Bottom 0.406: D1.P20 R4.P1
N$5
  Bottom 0.406: D1.P18 R5.P1
N$6
  Bottom 0.406: R6.P1 D1.P17
N$7
  Bottom 0.406: R7.P1 D1.P15
N$8
  Bottom 0.406: R8.P1 D1.P14
N$9
  Bottom 0.406: D1.P1 R9.P1
N$10
  Bottom 0.406: D1.P2 R10.P1
N$11
  Bottom 0.406: D1.P4 R11.P1
N$12
  Bottom 0.406: D1.P5 R12.P1
N$13
  Bottom 0.406: D1.P7 R13.P1
N$14
  Bottom 0.406: D1.P8 R14.P1
N$15
  Bottom 0.406: D1.P10 R15.P1
N$16
  Bottom 0.406: D1.P11 R16.P1
N$17  (via drill 0.6)
  Top 0.406: v59.18,116.08 59.44,115.82 65.79,115.82 66.04,116.08 U11.9 | U13.15 57.78,120.52 v57.91,120.65
  Bottom 0.406: v59.18,116.08 57.91,117.35 v57.91,120.65
N$18
  Bottom 0.406: D2.P24 R17.P1
N$19
  Bottom 0.406: R18.P1 D2.P23
N$20
  Bottom 0.406: R19.P1 D2.P21
N$21
  Bottom 0.406: R20.P1 D2.P20
N$22
  Bottom 0.406: R21.P1 D2.P18
N$23
  Bottom 0.406: R22.P1 D2.P17
N$24
  Bottom 0.406: R23.P1 D2.P15
N$25
  Bottom 0.406: R24.P1 D2.P14
N$26
  Bottom 0.406: R25.P1 D2.P1
N$27
  Bottom 0.406: R26.P1 D2.P2
N$28
  Bottom 0.406: R27.P1 D2.P4
N$29
  Bottom 0.406: R28.P1 D2.P5
N$30
  Bottom 0.406: R29.P1 D2.P7
N$31
  Bottom 0.406: R30.P1 D2.P8
N$32
  Bottom 0.406: R31.P1 D2.P10
N$33  (via drill 0.6)
  Top 0.406: v71.12,125.73 U11.2
  Bottom 0.406: R124.P1 71.12,122.91 v71.12,125.73
N$34  (via drill 0.6)
  Top 0.406: v66.04,125.73 U11.6
  Bottom 0.406: 66.04,124.95 v66.04,125.73 66.04,123.19 65.53,122.68 64.28,122.68 R123.P1
N$35  (via drill 0.6)
  Top 0.406: U11.8 64.77,120.65 63.75,121.67 v61.98,121.67
  Bottom 0.406: R121.P1 60.94,121.67 v61.98,121.67
N$36  (via drill 0.6)
  Top 0.406: v68.58,125.73 U11.4
  Bottom 0.406: R125.P1 68.58,123.68 v68.58,125.73
N$37  (via drill 0.6)
  Top 0.406: v87.63,125.73 U12.4
  Bottom 0.406: R128.P1 87.63,123.42 v87.63,125.73
N$38  (via drill 0.6)
  Top 0.406: U12.2 v90.17,125.73
  Bottom 0.406: v90.17,125.73 90.17,122.91 R122.P1
N$39  (via drill 0.6)
  Top 0.406: v80.26,123.7 83.82,120.14 U12.8
  Bottom 0.406: R127.P1 80.26,123.17 v80.26,123.7
N$40  (via drill 0.6)
  Top 0.406: v85.09,125.73 U12.6
  Bottom 0.406: R126.P1 85.09,124.44 v85.09,125.73
N$41
  Bottom 0.406: U10.P7 45.69,118.65 X1.P$1 46.48,118.36 C16.P1
N$42
  Bottom 0.406: U1.6 19.68,85.72 19.05,85.09 19.05,81.28 18.41,80.64 11.6,80.64 R3.P2 R4.P2
N$43
  Bottom 0.406: U10.P31 42.54,126.36 TX.P$1
N$44
  Bottom 0.406: C17.P1 46.48,115.82 X1.P$2 46.23,116.33 44.96,117.6 44.96,117.75 U10.P8
N$45
  Bottom 0.406: U10.P30 41.74,126.66 RX.P$1
N$46
  Bottom 0.406: R124.P2 71.37,119.28 Q3.1
N$47  (via drill 0.6)
  Top 0.406: v35.81,124.97 35.81,127.25 34.04,129.03 24.89,129.03 19.05,123.19 15.49,123.19 14.73,122.43 14.73,114.06 SW2.P2
  Bottom 0.406: U10.P24 35.81,124 v35.81,124.97
N$48  (via drill 0.6)
  Top 0.406: v34.29,124.97 34.29,127 33.02,128.27 25.4,128.27 18.34,121.21 SW1.P2
  Bottom 0.406: U10.P23 36.33,122.68 35.56,122.68 34.29,123.95 v34.29,124.97
N$49
  Bottom 0.406: U1.7 20.32,84.45 19.68,83.82 19.68,80.64 19.05,80.01 12.7,80.01 12.06,80.01 8.89,80.01 8.38,79.5 8.38,77.98 8.89,77.47 10.16,77.47 10.96,76.67 R2.P2 R1.P2
N$50
  Bottom 0.406: R121.P2 59.94,119.28 Q1.1
N$51
  Bottom 0.406: U1.5 19.05,87 18.41,86.36 18.41,81.92 17.78,81.28 12.7,81.28 11.94,82.04 11.94,84.58 10.96,85.56 R5.P2 R6.P2
N$52
  Bottom 0.406: U1.4 18.41,88.27 17.78,87.63 17.78,82.55 17.14,81.92 13.34,81.92 12.7,82.55 12.7,91.19 10.92,92.96 10.92,96.48 R7.P2 | R8.P2 R7.P2 | 10.96,96.36 R7.P2
N$53
  Bottom 0.406: U1.3 24.13,89.53 25.4,88.27 25.4,81.53 27.14,79.79 R10.P2 R9.P2
N$54
  Bottom 0.406: U1.2 24.13,90.81 26.04,88.9 26.04,84.92 R12.P2 R11.P2
N$55
  Bottom 0.406: U1.1 26.5,92.08 R14.P2 R13.P2
N$56
  Bottom 0.406: U1.15 17.78,90.81 20.32,93.34 26.54,93.34 27.18,93.98 27.18,96.48 R15.P2 R16.P2
N$74  (via drill 0.6)
  Top 0.406: v67.31,125.73 U11.5 | U13.14 58.55,119.25 58.93,119.63 58.93,123.7 59.69,124.46 60.71,124.46 v61.21,124.97
  Bottom 0.406: v61.21,124.97 61.21,126.24 61.98,127 66.55,127 67.31,126.24 v67.31,125.73
N$75  (via drill 0.6)
  Top 0.406: v45.97,83.19 v45.97,78.74
  Bottom 0.406: U4.9 v45.97,83.19 | U5.14 45.97,57.78 v45.97,78.74
N$76  (via drill 0.6)
  Top 0.406: v45.97,51.44 v45.97,46.99
  Bottom 0.406: U6.14 45.97,26.04 v45.97,46.99 | v45.97,51.44 U5.9
N$77
  Top 0.406: U11.1 72.39,127 71.63,127.76 63.25,127.76 62.48,127 62.48,123.95 62.23,123.7 60.71,123.7 59.94,122.94 59.94,118.87 59.05,117.98 U13.13
N$78  (via drill 0.6)
  Top 0.406: v13.97,83.19 v13.97,78.74
  Bottom 0.406: U1.9 v13.97,83.19 | U2.14 13.97,57.78 v13.97,78.74
N$79  (via drill 0.6)
  Top 0.406: v13.97,46.99 v13.97,51.44
  Bottom 0.406: U2.9 v13.97,51.44 | U3.14 13.97,26.04 v13.97,46.99
N$80
  Bottom 0.406: R32.P1 D2.P11
N$84
  Bottom 0.406: R25.P2 R26.P2 27.18,44.49 27.18,47.75 25.4,49.53 25.4,56.52 24.13,57.78 U2.3
N$85
  Bottom 0.406: R24.P2 R23.P2 10.92,64.73 10.92,61.47 12.7,59.69 12.7,50.8 13.34,50.17 17.14,50.17 17.78,50.8 17.78,55.88 18.41,56.52 U2.4
N$87
  Bottom 0.406: R20.P2 R19.P2 11.6,48.9 18.41,48.9 19.05,49.53 19.05,53.34 19.68,53.97 U2.6
N$97
  Bottom 0.406: R17.P2 R18.P2 10.96,45.17 10.41,45.72 8.64,45.72 8.13,46.23 8.13,47.75 8.64,48.26 12.06,48.26 12.19,48.26 19.05,48.26 19.68,48.9 19.68,52.07 20.32,52.7 U2.7
N$99
  Bottom 0.406: R22.P2 R21.P2 12.06,56.05 12.06,50.17 12.7,49.53 17.78,49.53 18.41,50.17 18.41,54.61 19.05,55.25 U2.5
N$102
  Bottom 0.406: R27.P2 R28.P2 26.04,53.17 26.04,57.15 24.13,59.06 U2.2
N$103
  Bottom 0.406: R29.P2 R30.P2 26.5,60.33 U2.1
N$104
  Bottom 0.406: R32.P2 R31.P2 27.18,64.73 27.18,62.74 26.04,61.59 20.32,61.59 17.78,59.06 U2.15
N$121  (via drill 0.6)
  Top 0.406: v77.72,83.19 v77.72,78.74
  Bottom 0.406: U7.9 v77.72,83.19 | U8.14 78.36,57.78 77.72,58.42 v77.72,78.74
N$122  (via drill 0.6)
  Top 0.406: v77.72,46.99 v77.72,51.44
  Bottom 0.406: U8.9 v77.72,51.44 | U9.14 77.72,26.04 v77.72,46.99
N$123
  Top 0.406: U13.12 56.29,116.59 57.4,116.59 57.91,117.09 59.44,117.09 60.96,118.62 60.96,122.43 61.47,122.94 62.99,122.94 63.5,123.44 63.5,126.49 64.01,127 69.34,127 69.85,126.49 U11.3
N$124
  Top 0.406: U12.5 86.36,126.49 85.6,127.25 80.01,127.25 78.99,126.24 78.99,123.19 79.76,122.43 79.76,115.82 78.99,115.06 57.91,115.06 57.66,115.32 56.29,115.32 U13.11
N$125
  Top 0.406: U12.9 85.09,114.3 84.58,113.79 57.91,113.79 57.66,114.05 56.29,114.05 U13.10
N$126  (via drill 0.6)
  Top 0.406: v92.46,112.78 56.29,112.78 U13.9 | U12.1 91.44,125.22 v91.95,125.73
  Bottom 0.406: v91.95,125.73 92.71,125.73 93.98,124.46 93.98,112.78 v92.46,112.78
N$127  (via drill 0.6)
  Top 0.406: U13.7 50.14,114.3 v53.34,114.3 | U12.3 v88.9,125.73
  Bottom 0.406: v53.34,114.3 53.34,121.41 59.94,128.02 72.64,128.02 73.66,127 73.66,126.24 74.68,125.22 77.22,125.22 77.98,125.98 77.98,127 78.99,128.02 87.88,128.02 88.9,127 v88.9,125.73
N$128  (via drill 0.6)
  Top 0.406: D10.A 49.53,128.27 45.72,124.46 38.86,124.46 37.08,122.68 34.29,122.68 v33.78,122.17
  Bottom 0.406: R289.P1 33.3,122.66 v33.78,122.17 34.11,121.85 U10.P22
N$129
  Bottom 0.406: R65.P1 D3.P24
N$130
  Bottom 0.406: R66.P1 D3.P23
N$131
  Bottom 0.406: R67.P1 D3.P21
N$132
  Bottom 0.406: R68.P1 D3.P20
N$133
  Bottom 0.406: R69.P1 D3.P18
N$134
  Bottom 0.406: R70.P1 D3.P17
N$135
  Bottom 0.406: R71.P1 D3.P15
N$136
  Bottom 0.406: D3.P14 R72.P1
N$137
  Bottom 0.406: R73.P1 D3.P1
N$138
  Bottom 0.406: R74.P1 D3.P2
N$139
  Bottom 0.406: R75.P1 D3.P4
N$140
  Bottom 0.406: R76.P1 D3.P5
N$141
  Bottom 0.406: R77.P1 D3.P7
N$142
  Bottom 0.406: R78.P1 D3.P8
N$143
  Bottom 0.406: R79.P1 D3.P10
N$144
  Bottom 0.406: R80.P1 D3.P11
N$161
  Bottom 0.406: R65.P2 R66.P2 14.77,16.51 19.05,16.51 19.68,17.14 19.68,20.32 20.32,20.95 U3.7
N$162
  Bottom 0.406: R68.P2 R67.P2 11.6,17.14 18.41,17.14 19.05,17.78 19.05,21.59 19.68,22.23 U3.6
N$163
  Bottom 0.406: R70.P2 R69.P2 10.96,25.23 12.06,24.13 12.06,18.41 12.7,17.78 17.78,17.78 18.41,18.41 18.41,22.86 19.05,23.5 U3.5
N$164
  Bottom 0.406: R72.P2 R71.P2 10.96,31.75 12.7,30.01 12.7,19.05 13.34,18.41 17.14,18.41 17.78,19.05 17.78,24.13 18.41,24.77 U3.4
N$165
  Bottom 0.406: R73.P2 R74.P2 25.4,14.44 25.4,24.77 24.13,26.04 U3.3
N$166
  Bottom 0.406: R75.P2 R76.P2 26.04,21.43 26.04,25.4 24.13,27.3 U3.2
N$167
  Bottom 0.406: R77.P2 R78.P2 26.5,28.58 U3.1
N$168
  Bottom 0.406: R80.P2 R79.P2 27.18,32.98 27.18,31.24 25.78,29.84 20.32,29.84 17.78,27.3 U3.15
N$185  (via drill 0.6)
  Top 0.406: v41.91,112.52 41.91,117.86 43.31,119.25 U13.3
  Bottom 0.406: U10.P12 40.89,116.32 40.89,114.3 41.91,113.28 v41.91,112.52
N$186  (via drill 0.6)
  Top 0.406: v40.64,112.52 40.64,118.87 42.29,120.52 U13.2
  Bottom 0.406: U10.P13 40.13,113.54 40.64,113.03 v40.64,112.52
N$187  (via drill 0.6)
  Top 0.406: 49.89,121.92 U13.1 42.04,121.79 39.37,119.13 v39.37,112.52
  Bottom 0.406: U10.P14 39.37,116.34 v39.37,112.52
N$188
  Bottom 0.406: C13.P1 36.25,120.14 U10.P20
N$193
  Bottom 0.406: D4.P24 R97.P1
N$194
  Bottom 0.406: R98.P1 D4.P23
N$195
  Bottom 0.406: R99.P1 D4.P21
N$196
  Bottom 0.406: R100.P1 D4.P20
N$197
  Bottom 0.406: R101.P1 D4.P18
N$198
  Bottom 0.406: R102.P1 D4.P17
N$199
  Bottom 0.406: R103.P1 D4.P15
N$200
  Bottom 0.406: R104.P1 D4.P14
N$201
  Bottom 0.406: D4.P1 R105.P1
N$202
  Bottom 0.406: D4.P2 R106.P1
N$203
  Bottom 0.406: D4.P4 R107.P1
N$204
  Bottom 0.406: D4.P5 R108.P1
N$205
  Bottom 0.406: D4.P7 R109.P1
N$206
  Bottom 0.406: D4.P8 R110.P1
N$207
  Bottom 0.406: D4.P10 R111.P1
N$208
  Bottom 0.406: D4.P11 R112.P1
N$210
  Bottom 0.406: R109.P2 R110.P2 58.26,92.08 U4.1
N$225
  Bottom 0.406: R97.P2 R98.P2 42.67,76.24 42.67,76.71 42.16,77.22 40.64,77.22 40.39,77.47 40.39,79.5 40.89,80.01 50.8,80.01 51.44,80.64 51.44,83.82 52.07,84.45 U4.7
N$226
  Bottom 0.406: R100.P2 R99.P2 42.71,81.11 43.18,80.64 50.16,80.64 50.8,81.28 50.8,85.09 51.44,85.72 U4.6
N$227
  Bottom 0.406: R102.P2 R101.P2 43.56,88.05 43.56,81.92 44.2,81.28 49.53,81.28 50.16,81.92 50.16,85.72 51.44,87 U4.5
N$228
  Bottom 0.406: R104.P2 R103.P2 42.67,96.48 42.67,92.96 44.2,91.44 44.2,82.55 44.83,81.92 48.9,81.92 49.53,82.55 49.53,87.63 50.16,88.27 U4.4
N$229
  Bottom 0.406: R105.P2 R106.P2 58.89,79.54 57.15,81.28 57.15,88.27 55.88,89.53 U4.3
N$230
  Bottom 0.406: R107.P2 R108.P2 57.78,84.92 57.78,88.9 55.88,90.81 U4.2
N$232
  Bottom 0.406: R112.P2 R111.P2 58.93,96.48 58.93,93.98 58.17,93.22 52.07,93.22 49.66,90.81 U4.15
N$242
  Bottom 0.406: R122.P2 90.49,121.05 Q7.1
N$243
  Bottom 0.406: 63.75,119.28 Q2.1 63.82,120.68 R123.P2
N$245
  Bottom 0.406: R125.P2 67.56,119.28 Q4.1
N$246
  Bottom 0.406: R126.P2 83.38,121.05 Q5.1
N$247
  Bottom 0.406: R127.P2 79.82,121.05 Q6.1
N$248
  Bottom 0.406: R128.P2 86.93,121.05 Q8.1
N$252
  Bottom 0.406: R129.P1 D5.P24
N$253
  Bottom 0.406: R130.P1 D5.P23
N$254
  Bottom 0.406: R131.P1 D5.P21
N$255
  Bottom 0.406: R132.P1 D5.P20
N$256
  Bottom 0.406: R133.P1 D5.P18
N$257
  Bottom 0.406: R134.P1 D5.P17
N$258
  Bottom 0.406: R135.P1 D5.P15
N$259
  Bottom 0.406: R136.P1 D5.P14
N$260
  Bottom 0.406: R137.P1 D5.P1
N$261
  Bottom 0.406: R138.P1 D5.P2
N$262
  Bottom 0.406: R139.P1 D5.P4
N$263
  Bottom 0.406: R140.P1 D5.P5
N$264
  Bottom 0.406: R141.P1 D5.P7
N$265
  Bottom 0.406: R142.P1 D5.P8
N$266
  Bottom 0.406: R143.P1 D5.P10
N$267
  Bottom 0.406: R144.P1 D5.P11
N$284
  Bottom 0.406: R130.P2 R129.P2 | R130.P2 42.71,44.62 | U5.7 52.07,52.7 51.44,52.07 51.44,48.9 50.8,48.26 41.66,48.26 41.15,47.75 41.15,45.97 41.4,45.72 42.16,45.72 42.67,45.21 42.67,44.49 R130.P2
N$285
  Bottom 0.406: R132.P2 R131.P2 43.09,48.9 50.16,48.9 50.8,49.53 50.8,53.34 51.44,53.97 U5.6
N$286
  Bottom 0.406: R134.P2 R133.P2 43.43,56.43 43.43,50.55 44.45,49.53 49.53,49.53 50.16,50.17 50.16,54.61 50.8,55.25 U5.5
N$287
  Bottom 0.406: R136.P2 R135.P2 42.67,64.73 42.67,61.47 44.2,59.94 44.2,51.05 45.09,50.17 48.9,50.17 49.53,50.8 49.53,55.88 50.16,56.52 U5.4
N$288
  Bottom 0.406: R137.P2 R138.P2 58.93,44.49 58.93,47.5 57.15,49.28 57.15,56.52 55.88,57.78 U5.3
N$289
  Bottom 0.406: R139.P2 R140.P2 57.78,53.17 57.78,57.15 55.88,59.06 U5.2
N$290
  Bottom 0.406: R141.P2 R142.P2 58.26,60.33 U5.1
N$291
  Bottom 0.406: R144.P2 R143.P2 58.93,64.73 58.93,62.74 57.78,61.59 52.07,61.59 49.53,59.06 U5.15
N$308
  Bottom 0.406: R161.P1 D6.P24
N$309
  Bottom 0.406: R162.P1 D6.P23
N$310
  Bottom 0.406: R163.P1 D6.P21
N$311
  Bottom 0.406: R164.P1 D6.P20
N$312
  Bottom 0.406: R165.P1 D6.P18
N$313
  Bottom 0.406: R166.P1 D6.P17
N$314
  Bottom 0.406: R167.P1 D6.P15
N$315
  Bottom 0.406: R168.P1 D6.P14
N$316
  Bottom 0.406: R169.P1 D6.P1
N$317
  Bottom 0.406: R170.P1 D6.P2
N$318
  Bottom 0.406: R171.P1 D6.P4
N$319
  Bottom 0.406: R172.P1 D6.P5
N$320
  Bottom 0.406: R173.P1 D6.P7
N$321
  Bottom 0.406: R174.P1 D6.P8
N$322
  Bottom 0.406: D6.P10 R175.P1
N$323
  Bottom 0.406: R176.P1 D6.P11
N$331
  Bottom 0.406: R161.P2 R162.P2 46.52,16.51 50.8,16.51 51.44,17.14 51.44,20.32 52.07,20.95 U6.7
N$341
  Bottom 0.406: R164.P2 R163.P2 43.34,17.14 50.16,17.14 50.8,17.78 50.8,21.59 51.44,22.23 U6.6
N$342
  Bottom 0.406: R166.P2 R165.P2 43.56,24.55 43.56,18.41 44.2,17.78 49.53,17.78 50.16,18.41 50.16,22.86 50.8,23.5 U6.5
N$343
  Bottom 0.406: R168.P2 R167.P2 42.71,29.68 44.2,28.19 44.2,19.3 45.09,18.41 48.9,18.41 49.53,19.05 49.53,24.13 50.16,24.77 U6.4
N$344
  Bottom 0.406: R169.P2 R170.P2 57.15,14.44 57.15,24.77 55.88,26.04 U6.3
N$345
  Bottom 0.406: R171.P2 R172.P2 57.78,21.43 57.78,25.4 55.88,27.3 U6.2
N$346
  Bottom 0.406: R173.P2 R174.P2 58.26,28.58 U6.1
N$347
  Bottom 0.406: R176.P2 R175.P2 58.93,32.98 58.93,31.24 57.4,29.72 51.94,29.72 49.53,27.3 U6.15
N$369
  Bottom 0.406: R193.P1 D7.P24
N$370
  Bottom 0.406: R194.P1 D7.P23
N$371
  Bottom 0.406: R195.P1 D7.P21
N$372
  Bottom 0.406: R196.P1 D7.P20
N$373
  Bottom 0.406: R197.P1 D7.P18
N$374
  Bottom 0.406: R198.P1 D7.P17
N$375
  Bottom 0.406: R199.P1 D7.P15
N$376
  Bottom 0.406: R200.P1 D7.P14
N$377
  Bottom 0.406: R201.P1 D7.P1
N$378
  Bottom 0.406: R202.P1 D7.P2
N$379
  Bottom 0.406: R203.P1 D7.P4
N$380
  Bottom 0.406: D7.P5 R204.P1
N$381
  Bottom 0.406: D7.P7 R205.P1
N$382
  Bottom 0.406: D7.P8 R206.P1
N$383
  Bottom 0.406: D7.P10 R207.P1
N$384
  Bottom 0.406: R208.P1 D7.P11
N$401
  Bottom 0.406: R194.P2 R193.P2 | R194.P2 74.46,76.36 | U7.7 83.82,84.45 83.19,83.82 83.19,80.64 82.55,80.01 72.64,80.01 72.14,79.5 72.14,77.72 72.64,77.22 73.91,77.22 74.42,76.71 74.42,76.24 R194.P2
N$402
  Bottom 0.406: R196.P2 R195.P2 74.59,80.64 81.92,80.64 82.55,81.28 82.55,85.09 83.19,85.72 U7.6
N$403
  Bottom 0.406: R198.P2 R197.P2 74.46,85.31 75.18,84.58 75.18,82.3 76.2,81.28 81.28,81.28 81.92,81.92 81.92,85.72 83.19,87 U7.5
N$404
  Bottom 0.406: R200.P2 R199.P2 74.46,93.18 75.95,91.69 75.95,82.8 76.83,81.92 80.64,81.92 81.28,82.55 81.28,87.63 81.92,88.27 U7.4
N$405
  Bottom 0.406: R201.P2 R202.P2 90.64,79.54 88.9,81.28 88.9,88.27 87.63,89.53 U7.3
N$406
  Bottom 0.406: R203.P2 R204.P2 89.53,84.92 89.53,88.9 87.63,90.81 U7.2
N$407
  Bottom 0.406: R205.P2 R206.P2 90,92.08 U7.1
N$408
  Bottom 0.406: R208.P2 R207.P2 90.68,96.48 90.68,94.23 89.66,93.22 84.33,93.22 83.82,92.71 83.69,92.58 81.92,90.81 U7.15
N$428
  Bottom 0.406: R225.P1 D8.P24
N$429
  Bottom 0.406: R226.P1 D8.P23
N$430
  Bottom 0.406: R227.P1 D8.P21
N$431
  Bottom 0.406: D8.P20 R228.P1
N$432
  Bottom 0.406: R229.P1 D8.P18
N$433
  Bottom 0.406: R230.P1 D8.P17
N$434
  Bottom 0.406: R231.P1 D8.P15
N$435
  Bottom 0.406: D8.P14 R232.P1
N$436
  Bottom 0.406: R233.P1 D8.P1
N$437
  Bottom 0.406: R234.P1 D8.P2
N$438
  Bottom 0.406: R235.P1 D8.P4
N$439
  Bottom 0.406: R236.P1 D8.P5
N$440
  Bottom 0.406: R237.P1 D8.P7
N$441
  Bottom 0.406: R238.P1 D8.P8
N$442
  Bottom 0.406: R239.P1 D8.P10
N$443
  Bottom 0.406: R240.P1 D8.P11
N$460
  Bottom 0.406: R225.P2 R226.P2 74.42,44.49 74.42,45.21 73.91,45.72 73.15,45.72 72.9,45.97 72.9,47.75 73.41,48.26 82.55,48.26 83.19,48.9 83.19,52.07 83.82,52.7 U8.7
N$461
  Bottom 0.406: R228.P2 R227.P2 74.84,48.9 81.92,48.9 82.55,49.53 82.55,53.34 83.19,53.97 U8.6
N$462
  Bottom 0.406: R230.P2 R229.P2 74.46,56.86 75.18,56.13 75.18,50.55 76.2,49.53 81.28,49.53 81.92,50.17 81.92,54.61 82.55,55.25 U8.5
N$463
  Bottom 0.406: R232.P2 R231.P2 74.42,64.73 74.42,61.47 75.95,59.94 75.95,51.05 76.83,50.17 80.64,50.17 81.28,50.8 81.28,55.88 81.92,56.52 U8.4
N$464
  Bottom 0.406: R233.P2 R234.P2 90.64,47.5 88.9,49.24 88.9,56.52 87.63,57.78 U8.3
N$465
  Bottom 0.406: R235.P2 R236.P2 89.53,53.17 89.53,57.15 87.63,59.06 U8.2
N$466
  Bottom 0.406: R237.P2 R238.P2 90,60.33 U8.1
N$467
  Bottom 0.406: R240.P2 R239.P2 90.68,64.73 90.68,62.48 89.79,61.59 83.82,61.59 81.28,59.06 U8.15
N$484
  Bottom 0.406: R257.P1 D9.P24
N$485
  Bottom 0.406: R258.P1 D9.P23
N$486
  Bottom 0.406: R259.P1 D9.P21
N$487
  Bottom 0.406: R260.P1 D9.P20
N$488
  Bottom 0.406: R261.P1 D9.P18
N$489
  Bottom 0.406: R262.P1 D9.P17
N$490
  Bottom 0.406: R263.P1 D9.P15
N$491
  Bottom 0.406: R264.P1 D9.P14
N$492
  Bottom 0.406: R265.P1 D9.P1
N$493
  Bottom 0.406: R266.P1 D9.P2
N$494
  Bottom 0.406: R267.P1 D9.P4
N$495
  Bottom 0.406: R268.P1 D9.P5
N$496
  Bottom 0.406: R269.P1 D9.P7
N$497
  Bottom 0.406: R270.P1 D9.P8
N$498
  Bottom 0.406: R271.P1 D9.P10
N$499
  Bottom 0.406: R272.P1 D9.P11
N$501
  Bottom 0.406: R269.P2 R270.P2 90,28.58 U9.1
N$516
  Bottom 0.406: R257.P2 R258.P2 78.27,16.51 82.55,16.51 83.19,17.14 83.19,20.32 83.82,20.95 U9.7
N$517
  Bottom 0.406: R260.P2 R259.P2 75.09,17.14 81.92,17.14 82.55,17.78 82.55,21.59 83.19,22.23 U9.6
N$518
  Bottom 0.406: R262.P2 R261.P2 75.56,24.3 75.56,18.41 76.2,17.78 81.28,17.78 81.92,18.41 81.92,22.86 82.55,23.5 U9.5
N$519
  Bottom 0.406: R264.P2 R263.P2 | R263.P2 74.46,32.86 | U9.4 81.92,24.77 81.28,24.13 81.28,19.05 80.64,18.41 76.83,18.41 76.2,19.05 76.2,27.94 74.42,29.72 74.42,32.98 R263.P2
N$520
  Bottom 0.406: R265.P2 R266.P2 88.9,14.44 88.9,24.77 87.63,26.04 U9.3
N$521
  Bottom 0.406: R267.P2 R268.P2 89.53,21.43 89.53,25.4 87.63,27.3 U9.2
N$523
  Bottom 0.406: R272.P2 R271.P2 90.68,32.98 90.68,31.24 89.28,29.84 83.82,29.84 81.28,27.3 U9.15
RCK  (via drill 0.6)
  Top 0.406: v13.97,23.62 14.1,23.5 14.73,23.5 16,22.23 16,16 17.02,14.99 v21.84,14.99 28.45,14.99 29.97,16.51 43.18,16.51 43.69,17.02 43.69,22.35 44.96,23.62 v45.97,23.62 46.86,23.62 47.75,22.73 47.75,17.02 48.26,16.51 74.93,16.51 75.44,17.02 75.44,22.1 76.96,23.62 v77.47,23.62 | v13.97,55.37 14.1,55.25 14.48,55.25 16.26,53.47 16.26,43.69 16.76,43.18 v21.84,43.18 43.69,43.18 44.2,43.69 44.2,54.1 45.47,55.37 v45.97,55.37 46.1,55.25 46.48,55.25 48.01,53.72 48.01,43.94 48.77,43.18 74.93,43.18 75.69,43.94 75.69,54.36 76.71,55.37 v77.72,55.37 | v13.97,87.12 14.73,87.12 16.26,85.6 16.26,75.95 17.27,74.93 v21.84,74.93 43.18,74.93 44.2,75.95 44.2,85.85 45.47,87.12 v45.97,87.12 46.1,87 46.48,87 47.75,85.72 47.75,76.2 49.02,74.93 75.18,74.93 75.95,75.69 75.95,85.85 77.22,87.12 v77.72,87.12 | v21.84,17.02 v21.84,30.99 | v21.84,47.75 v21.84,62.99 | v21.84,111.25 21.84,112.27 26.42,116.84 27.94,116.84 28.7,117.6 28.7,119.38 28.96,119.63 37.08,119.63 40.13,122.68 v40.39,122.68 | v21.84,80.26 v21.84,96.27
  Bottom 0.406: U2.12 14.1,55.25 v13.97,55.37 | U3.12 14.1,23.5 v13.97,23.62 | U9.12 77.6,23.5 v77.47,23.62 | U8.12 77.6,55.25 v77.72,55.37 | U4.12 45.85,87 v45.97,87.12 | U1.12 14.1,87 v13.97,87.12 | U6.12 46.1,23.5 v45.97,23.62 | U5.12 46.1,55.25 v45.97,55.37 | U7.12 77.85,87 v77.72,87.12 | v21.84,14.99 v21.84,17.02 | v21.84,30.99 v21.84,43.18 v21.84,47.75 | v21.84,62.99 v21.84,74.93 v21.84,80.26 | v21.84,96.27 v21.84,111.25 | v40.39,122.68 44.83,122.68 U10.P2
ROW0  (via drill 0.6)
  Top 0.406: 40.7,23.37 v40.89,23.37 40.89,28.19 v44.45,31.75 | D5.P22 v42.16,46.99 42.16,61.21 v44.45,63.5 | D8.P22 v73.91,46.99 73.91,61.21 v76.2,63.5 | v72.39,23.37 72.39,28.19 v75.95,31.75 | v41.91,78.74 40.39,78.74 | 40.39,78.74 D4.P22 | D7.P22 v73.66,78.74 73.66,92.71 v75.69,94.74 | v75.69,110.24 v60.96,110.24 v44.7,110.24 27.18,110.24 25.91,108.97 9.14,108.97 v8.64,109.47 | 40.39,78.74 40.39,93.22 41.91,94.74 v44.7,94.74 | v9.14,23.37 9.14,28.7 v12.95,32.51 | D2.P22 v9.4,46.99 9.4,60.2 v12.7,63.5 | v10.16,78.74 8.64,78.74 | 8.64,78.74 D1.P22 | 8.64,78.74 v8.64,100.58
  Bottom 0.406: v40.89,23.37 40.89,22.61 39.88,21.59 37.85,21.59 37.34,21.08 37.34,16.7 D6.P22 | v72.39,23.37 72.39,22.61 71.37,21.59 69.6,21.59 69.09,21.08 69.09,16.7 D9.P22 | v42.16,46.99 44.45,44.7 v44.45,31.75 | v75.95,31.75 75.95,44.96 v73.91,46.99 | v44.45,63.5 44.45,76.2 v41.91,78.74 | v76.2,63.5 76.2,76.2 v73.66,78.74 | D3.P22 5.33,16.96 5.33,20.83 6.1,21.59 7.87,21.59 9.14,22.86 v9.14,23.37 | v12.95,32.51 12.95,44.7 10.67,46.99 v9.4,46.99 | v12.7,63.5 12.7,76.96 10.92,78.74 v10.16,78.74 | v75.69,94.74 v75.69,110.24 | Q1.3 v60.96,110.24 | v8.64,100.58 v8.64,109.47 | v44.7,94.74 v44.7,110.24
ROW1  (via drill 0.6)
  Top 0.406: D4.P19 v35.56,86.36 | 35.81,54.61 D5.P19 v35.56,54.61 | v67.31,86.36 D7.P19 | D8.P19 v67.31,54.61 | D1.P19 v3.81,86.36 | D2.P19 v3.81,54.61 | v3.81,107.19 v35.56,107.19 v63.5,107.19 v67.31,107.19
  Bottom 0.406: D6.P19 35.56,26.1 v35.56,54.61 v35.56,86.36 v35.56,107.19 | D9.P19 67.31,26.1 v67.31,54.61 v67.31,86.36 v67.31,107.19 | D3.P19 3.81,26.1 v3.81,54.61 v3.81,86.36 v3.81,107.19 | Q2.3 64.77,108.46 v63.5,107.19
ROW2  (via drill 0.6)
  Top 0.406: D4.P16 v36.58,93.98 | D5.P16 v36.58,62.23 | D7.P16 v68.33,93.98 | D8.P16 v68.33,62.23 | D1.P16 v4.83,93.98 | D2.P16 v4.83,62.23 | v4.83,105.16 v36.58,105.16 v68.33,105.16 v72.39,105.16
  Bottom 0.406: D6.P16 36.58,32.7 v36.58,62.23 v36.58,93.98 v36.58,105.16 | D9.P16 68.33,32.7 v68.33,62.23 v68.33,93.98 v68.33,105.16 | D3.P16 4.83,32.7 v4.83,62.23 v4.83,93.98 v4.83,105.16 | Q3.3 v72.39,105.16
ROW3  (via drill 0.6)
  Top 0.406: v69.34,108.2 v37.59,108.2 v5.84,108.2
  Bottom 0.406: D4.P13 37.59,100.39 | 37.59,100.39 37.59,69.85 | 37.59,69.85 37.59,39.31 D6.P13 | 69.34,101.6 69.34,69.85 | 69.34,69.85 69.34,39.31 D9.P13 | D8.P13 69.34,69.85 | D1.P13 5.84,100.39 | 5.84,100.39 5.84,69.85 | 5.84,69.85 5.84,39.31 D3.P13 | D2.P13 5.84,69.85 | 37.59,100.39 v37.59,108.2 | 5.84,100.39 v5.84,108.2 | D5.P13 37.59,69.85 | 69.34,101.6 D7.P13 | 69.34,101.6 v69.34,108.2 68.58,108.97 Q4.3
ROW4  (via drill 0.6)
  Top 0.406: 29.4,23.62 v29.21,23.62 29.21,28.45 v25.91,31.75 | D2.P3 v25.91,46.99 v25.91,63.5 | D1.P3 v25.91,78.74 v25.91,94.49 | D4.P3 v57.66,78.74 v57.66,94.49 | D5.P3 v57.66,46.99 v57.66,63.5 | v60.96,23.37 60.96,28.45 v57.66,31.75 | v30.99,109.22 v57.66,109.22 v84.33,109.22 v89.15,109.22 | v91.95,23.11 91.95,28.7 v89.15,31.5 | D8.P3 v89.15,46.99 v89.15,63.5 | D7.P3 v89.15,78.74 v89.15,94.49
  Bottom 0.406: v29.21,23.62 29.21,22.61 30.23,21.59 32,21.59 32.51,21.08 32.51,16.7 D3.P3 | v60.96,23.37 60.96,22.61 61.98,21.59 64.01,21.59 64.52,21.08 64.52,16.96 D6.P3 | v25.91,46.99 v25.91,31.75 | v25.91,78.74 v25.91,63.5 | v57.66,78.74 v57.66,63.5 | v57.66,31.75 v57.66,46.99 | D9.P3 96.27,16.96 96.27,20.83 95.5,21.59 93.22,21.59 91.95,22.86 v91.95,23.11 | v89.15,31.5 v89.15,46.99 | v89.15,63.5 v89.15,78.74 | v57.66,94.49 v57.66,109.22 | Q5.3 v84.33,109.22 | v89.15,94.49 v89.15,109.22 | v25.91,94.49 25.91,104.14 v30.99,109.22
ROW5  (via drill 0.6)
  Top 0.406: D1.P6 v34.29,86.36 | D2.P6 v34.29,54.61 | D4.P6 v66.04,86.36 | D5.P6 v66.04,54.61 | D7.P6 v97.79,86.36 | D8.P6 v97.79,54.61 | v34.29,104.14 v66.04,104.14 v80.52,104.14 v97.79,104.14
  Bottom 0.406: D3.P6 34.29,26.1 v34.29,54.61 v34.29,86.36 v34.29,104.14 | D6.P6 66.04,26.1 v66.04,54.61 v66.04,86.36 v66.04,104.14 66.04,104.39 | D9.P6 97.79,26.1 v97.79,54.61 v97.79,86.36 v97.79,104.14 | Q6.3 v80.52,104.14
ROW6  (via drill 0.6)
  Top 0.406: D1.P9 v33.27,93.98 | D2.P9 v33.27,62.23 | D4.P9 v65.02,93.98 | D5.P9 v65.02,62.23 | D7.P9 v96.77,93.98 | D8.P9 v96.77,62.23 | v96.77,106.17 v91.44,106.17 v65.02,106.17 v33.27,106.17
  Bottom 0.406: D3.P9 33.27,32.7 v33.27,62.23 v33.27,93.98 v33.27,106.17 | D6.P9 65.02,32.7 v65.02,62.23 v65.02,93.98 v65.02,106.17 | D9.P9 96.77,32.7 v96.77,62.23 v96.77,93.98 v96.77,106.17 | Q7.3 v91.44,106.17
ROW7  (via drill 0.6)
  Top 0.406: v32.26,103.12 v64.01,103.12 v87.88,103.12 v95.76,103.12
  Bottom 0.406: D1.P12 31.05,101.54 32.26,100.33 | 32.26,100.33 32.26,69.85 | 32.26,69.85 32.26,39.31 D3.P12 | D2.P12 32.26,69.85 | 64.01,101.66 64.01,69.85 | 64.01,69.85 64.01,39.31 D6.P12 | D5.P12 64.01,69.85 | v95.76,103.12 95.76,101.6 | 95.76,101.6 95.76,69.85 | 95.76,69.85 95.76,39.31 D9.P12 | D8.P12 95.76,69.85 | 32.26,100.33 v32.26,103.12 | D4.P12 63.95,101.6 64.01,101.66 | 64.01,101.66 v64.01,103.12 | D7.P12 95.76,101.6 | Q8.3 v87.88,103.12
SCK  (via drill 0.6)
  Top 0.406: v13.97,22.35 14.1,22.23 14.73,22.23 15.24,21.72 15.24,15.24 16.51,13.97 v23.11,13.97 43.18,13.97 44.45,15.24 44.45,21.59 45.21,22.35 v45.97,22.35 46.23,22.35 46.99,21.59 46.99,15.24 48.26,13.97 74.93,13.97 76.2,15.24 76.2,21.59 76.96,22.35 v77.47,22.35 | v13.97,54.1 14.1,53.97 14.48,53.97 15.49,52.96 15.49,41.4 16.76,40.13 v23.11,40.13 43.69,40.13 44.96,41.4 44.96,53.09 v45.97,54.1 46.1,53.97 46.48,53.97 47.24,53.21 47.24,41.4 48.51,40.13 75.44,40.13 76.45,41.15 76.45,53.59 76.96,54.1 v77.72,54.1 77.22,54.1 | v13.97,85.85 14.48,85.85 15.24,85.09 15.24,72.64 16.51,71.37 v23.11,71.37 44.2,71.37 44.96,72.14 44.96,85.34 45.47,85.85 v45.97,85.85 46.1,85.72 46.48,85.72 46.99,85.22 46.99,72.39 48.01,71.37 75.44,71.37 76.71,72.9 76.71,85.34 77.22,85.85 v77.72,85.85 | v23.11,30.99 v23.11,17.02 | v23.11,47.75 v23.11,62.99 | v23.11,111.25 23.11,112.27 26.92,116.08 v30.48,116.08 | v23.11,78.74 v23.11,94.49
  Bottom 0.406: U2.11 14.1,53.97 v13.97,54.1 | U3.11 14.1,22.23 v13.97,22.35 | U9.11 77.6,22.23 v77.47,22.35 | U8.11 77.6,53.97 v77.72,54.1 | U4.11 46.1,85.72 v45.97,85.85 | U1.11 14.1,85.72 v13.97,85.85 | U6.11 46.1,22.23 v45.97,22.35 | v45.97,54.1 46.1,53.97 U5.11 | U7.11 77.85,85.72 v77.72,85.85 | v23.11,17.02 v23.11,13.97 | v23.11,47.75 v23.11,40.13 v23.11,30.99 | v23.11,62.99 v23.11,71.37 v23.11,78.74 | v23.11,94.49 v23.11,111.25 | U10.P1 44.44,123.45 44.2,123.7 39.12,123.7 37.85,122.43 37.85,118.36 37.33,117.85 U10.P17 36.36,116.37 35.56,115.57 30.99,115.57 v30.48,116.08 29.21,116.08 28.7,116.59 28.7,119.63 J1.P3
SDATA1  (via drill 0.6)
  Bottom 0.406: U1.14 14.1,89.53 v13.97,89.66 13.97,103.89 19.56,109.47 19.56,112.27 20.57,113.28 31.24,113.28 33.27,111.25 42.42,111.25 43.18,112.01 43.18,113.28 41.66,114.81 41.66,116.29 U10.P11
SDATA2  (via drill 0.6)
  Bottom 0.406: U4.14 46.1,89.53 v45.97,89.66 45.97,111.25 44.96,112.27 44.96,113.79 43.34,115.41 U10.P9
SDATA3  (via drill 0.6)
  Top 0.406: v77.72,111.51 v52.07,111.51
  Bottom 0.406: U7.14 77.85,89.53 v77.72,89.66 v77.72,111.51 | v52.07,111.51 52.07,121.92 49.02,124.97 43.48,124.97 U10.P32

## Text on the board
bPlace: v1.0 9/20/2012 | QR Clock | ch00ftech